# EAGLE design IOB-Adapter-Minimal (EAGLE 7.7.0)
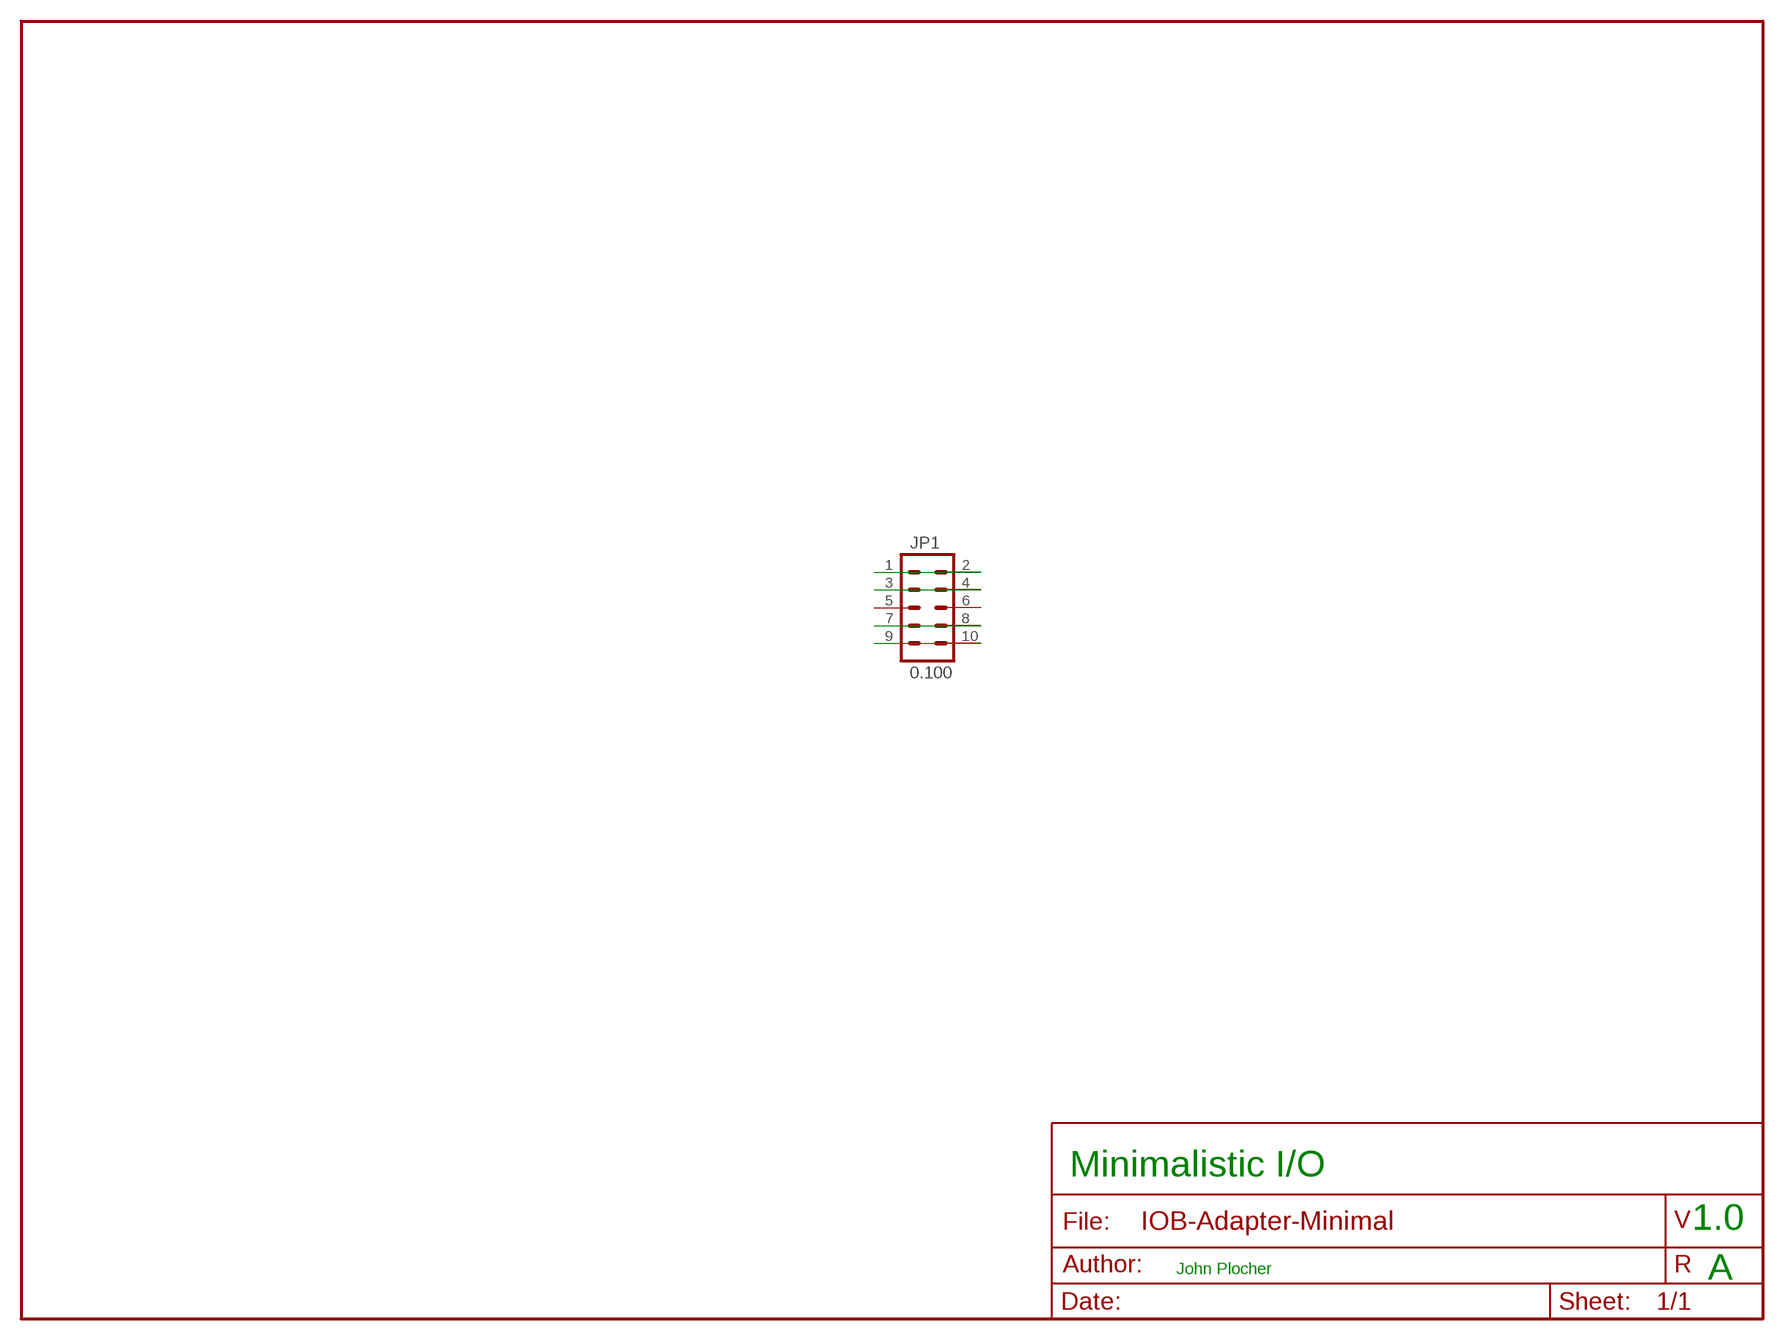
[diagram p0: schematic, sheet 1]

## Parts
JP1  0.100  CONNECTOR-M05X2NO_SILK  [2X5_NOSILK]

## Nets
N$1: JP1.1 JP1.2
N$2: JP1.3 JP1.4
N$4: JP1.7 JP1.8
N$5: JP1.9 JP1.10
Unconnected: JP1.5 JP1.6

## Notes on the sheet
- Minimalistic I/O
- 1.0
- John Plocher
- A

## Library data of the parts
JP1 = SPCoast:CONNECTOR-M05X2: Header 5x2 Standard 10-pin dual row 0.1" header. Commonly used with AVR-ISP. Use with Spark Fun Electronics SKU: PRT-00778

## Net classes
0 default: width 0.254 mm, drill 0.4 mm, clearance 0.127 mm
1 Power: width 0.254 mm, drill 0.4 mm, clearance 0.127 mm
2 signals: width 0.254 mm, drill 0.4 mm, clearance 0.127 mm

## Board
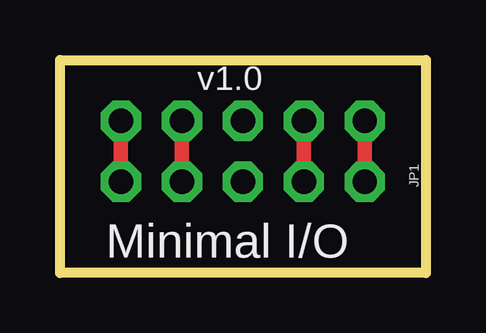
[diagram p1: board, top side]
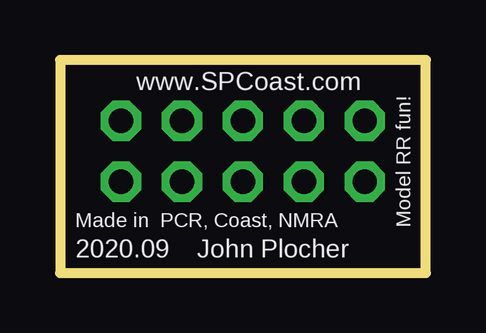
[diagram p2: board, bottom side, seen from below]

Size 15.24 x 8.89 mm. Coordinates in mm from the lower left corner, seen from the top.
Outline: 0,8.89 15.24,8.89 15.24,0 0,0 0,8.89
Copper layers (1*16): Top 0.035mm / dielectric 1.5mm / Bottom 0.035mm
Design rules "default": minimum track width 10mil, minimum drill 0.6mm, track to track 8mil, track to pad 8mil, pad to pad 8mil, via to via 8mil, smd to smd 8mil, copper to edge 40mil, drill to drill 8mil, minimum pad ring 10mil, minimum via ring 8mil, stop-mask expansion 4mil, vias tented up to drill 0mil, thermal gap 10mil

### Footprints (pad centres in the part's own frame; a part is rotated, then mirrored left to right if it is on the bottom)
2X5_NOSILK = drill 1.016 pad 1.676 octagon: 1 -1.27,5.08; 2 1.27,5.08; 3 -1.27,2.54; 4 1.27,2.54; 5 -1.27,0; 6 1.27,0; 7 -1.27,-2.54; 8 1.27,-2.54; 9 -1.27,-5.08; 10 1.27,-5.08

### Placement (x,y rotation side)
JP1  7.62,5.08 270 bottom

### Tracks (layer width: path | path; a pad name or v marks a point on that pad's centre or on a via)
N$1
  Top 0.61: JP1.1 JP1.2
N$2
  Top 0.61: JP1.3 JP1.4
N$4
  Top 0.61: JP1.7 JP1.8
N$5
  Top 0.61: JP1.9 JP1.10

### Text on the board
tPlace: v1.0 | Minimal I/O
bPlace: www.SPCoast.com | Model RR fun! | Made in PCR, Coast, NMRA | John Plocher | 2020.09
Document: Yellow
_tNames: JP1